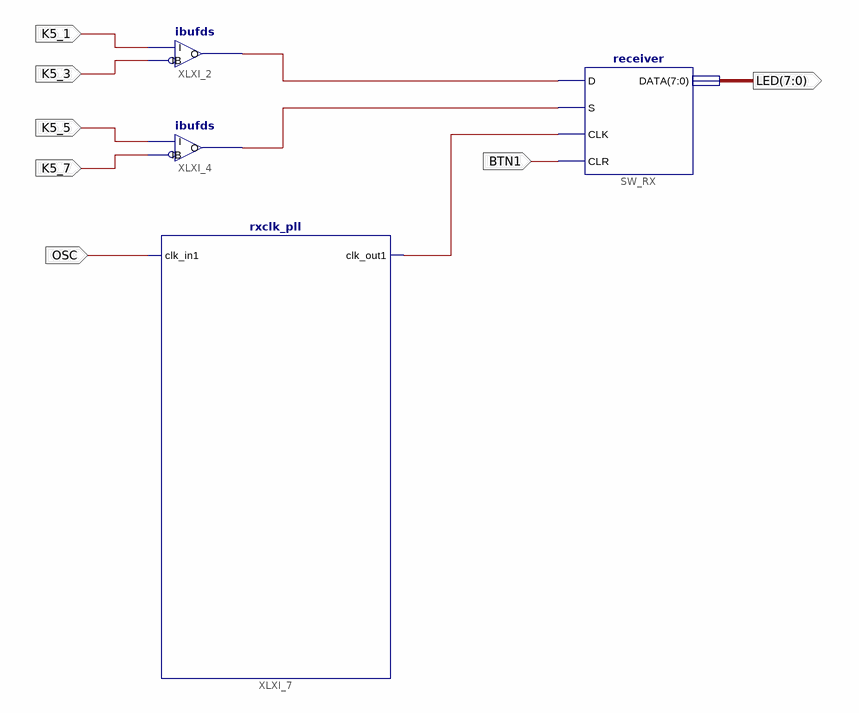
[diagram p0: schematic sheet 1]
// Xilinx ISE schematic big.sch (spartan6) as structural Verilog: 4 symbols, 7 ports
module big (
  input  K5_1,
  input  K5_3,
  input  K5_5,
  input  K5_7,
  input  OSC,
  input  BTN1,
  output [7:0] LED
);

  wire XLXN_11, XLXN_12, XLXN_16;

  ibufds #(.DIFF_TERM("TRUE")) XLXI_2 (.I(K5_1), .IB(K5_3), .O(XLXN_11));
  ibufds #(.DIFF_TERM("TRUE")) XLXI_4 (.I(K5_5), .IB(K5_7), .O(XLXN_12));
  receiver SW_RX (.CLK(XLXN_16), .CLR(BTN1), .D(XLXN_11), .DATA(LED), .S(XLXN_12));
  rxclk_pll XLXI_7 (.clk_in1(OSC), .clk_out1(XLXN_16));
endmodule
